# Altium schematic sheet HMI_Buttons.SchDoc
size A4; SheetNumber: 15; SheetTotal: 18
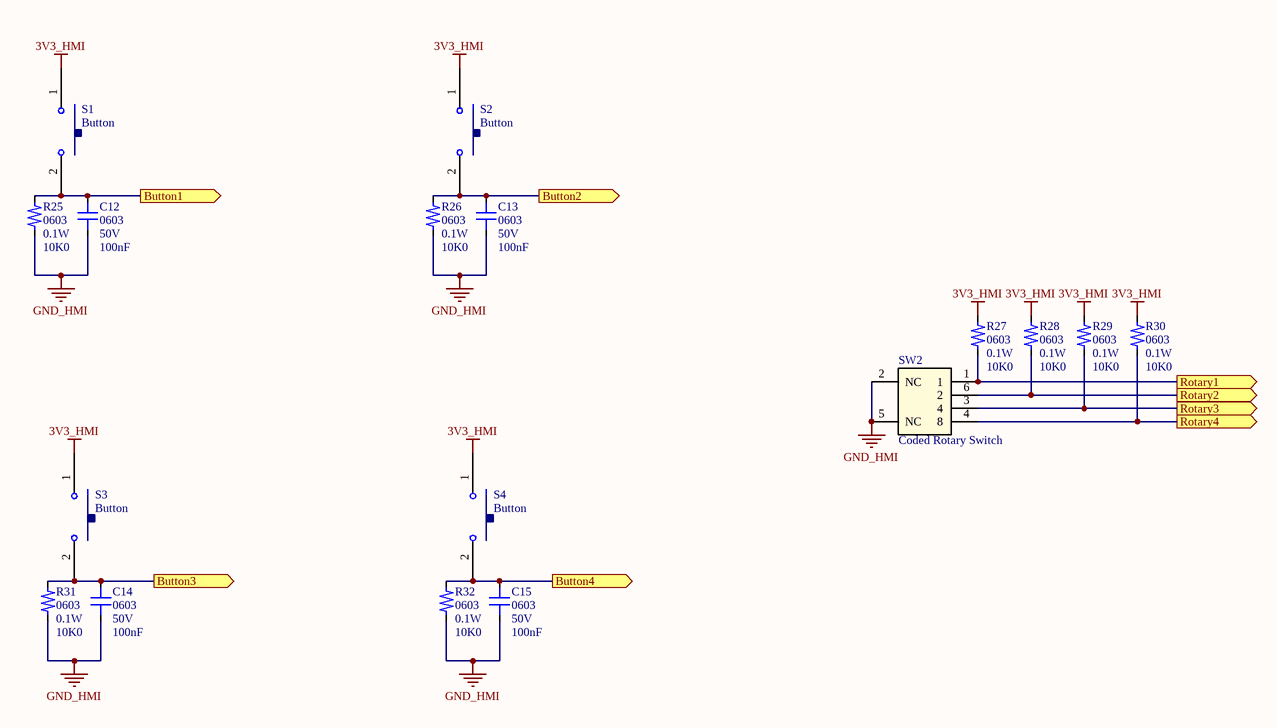
[diagram p0: HMI_Buttons.SchDoc]

## Parts
C12  0603  value 100nF  Rating: 50V  [C_0603]
C13  0603  value 100nF  Rating: 50V  [C_0603]
C14  0603  value 100nF  Rating: 50V  [C_0603]
C15  0603  value 100nF  Rating: 50V  [C_0603]
R25  0603  value 10K0  Rating: 0.1W  [R_0603]
R26  0603  value 10K0  Rating: 0.1W  [R_0603]
R27  0603  value 10K0  Rating: 0.1W  [R_0603]
R28  0603  value 10K0  Rating: 0.1W  [R_0603]
R29  0603  value 10K0  Rating: 0.1W  [R_0603]
R30  0603  value 10K0  Rating: 0.1W  [R_0603]
R31  0603  value 10K0  Rating: 0.1W  [R_0603]
R32  0603  value 10K0  Rating: 0.1W  [R_0603]
S1  Button  [Switch]
S2  Button  [Switch]
S3  Button  [Switch]
S4  Button  [Switch]
SW2  Coded Rotary Switch  [221AMC16R]

## Ports
Button1 (out), Button2 (out), Button3 (out), Button4 (out), Rotary1 (out), Rotary2 (out), Rotary3 (out), Rotary4 (out)

## Nets
3V3_HMI: R27.2(R2) R28.2(R2) R29.2(R2) R30.2(R2) S1.1 S2.1 S3.1 S4.1
GND_HMI: C12.1(C1) C13.1(C1) C14.1(C1) C15.1(C1) R25.1(R1) R26.1(R1) R31.1(R1) R32.1(R1) SW2.2(NC) SW2.5(NC)
Button1: C12.2(C2) R25.2(R2) S1.2 ; port Button1
Button2: C13.2(C2) R26.2(R2) S2.2 ; port Button2
Button3: C14.2(C2) R31.2(R2) S3.2 ; port Button3
Button4: C15.2(C2) R32.2(R2) S4.2 ; port Button4
Rotary1: R27.1(R1) SW2.1 ; port Rotary1
Rotary2: R28.1(R1) SW2.6(2) ; port Rotary2
Rotary3: R29.1(R1) SW2.3(4) ; port Rotary3
Rotary4: R30.1(R1) SW2.4(8) ; port Rotary4

## Library data of the parts
C12-C15 = CC0603KRX7R9BB104: NI Part Number: 716340-01; Type: Chip Capacitor; Tolerance: 10%; ID: Cap_0603_100nF_50V_Chip; NI PEN/DEB: DEB; Part Number: CC0603KRX7R9BB104; Order Number: 82-06-23; Distributor: Lomex; Link: http://lomex.hu/hu/webshop/#/page,0/search,82-06-23/stype,1/sidx,1; Price (HUF): 2.00; Package: 0603
R25-R32 = CR-03FL7---10K: NI part number: 713771-01; Tolerance: 1%; ID: Res_0603_10K0_0.1W_Chip; NI PEN/DEB: DEB; Type: Chip Resistor; Part Number: CR-03FL7---10K; Order Number: 80-11-68; Distributor: Lomex; Link: http://lomex.hu/hu/webshop/#/page,0/search,80-11-68/stype,1/sidx,1; Price (HUF): 0.80; Package: 0603
S1-S4 = FSM2JSMA: ID: Oth_FSM2JSMA_SWITCH; Note: 4 Pin; Rating: 50mA; Distributor: Lomex; Link: http://lomex.hu/hu/webshop/#/page,0/stype,1/sidx,6/search,45-05-42; Order number: 45-05-42; Package: SWITCH; Part Number: FSM2JSMA; Price (HUF): 41; Type: Button; NI part number: -; NI PEN/DEB: -
SW2 = 221AMC16R: Number of positions: 16; Output code: Hexadecimal; Voltage rating: 50 V; Current rating: 100 mA; Link: https://hu.mouser.com/ProductDetail/CTS-Electronic-Components/221AMC16R?qs=%252BiOMRfgENTE0%252BGMxeYu5rQ%3D%3D